# Altium schematic sheet nrf52840.SchDoc
size 1651 x 1651 mm
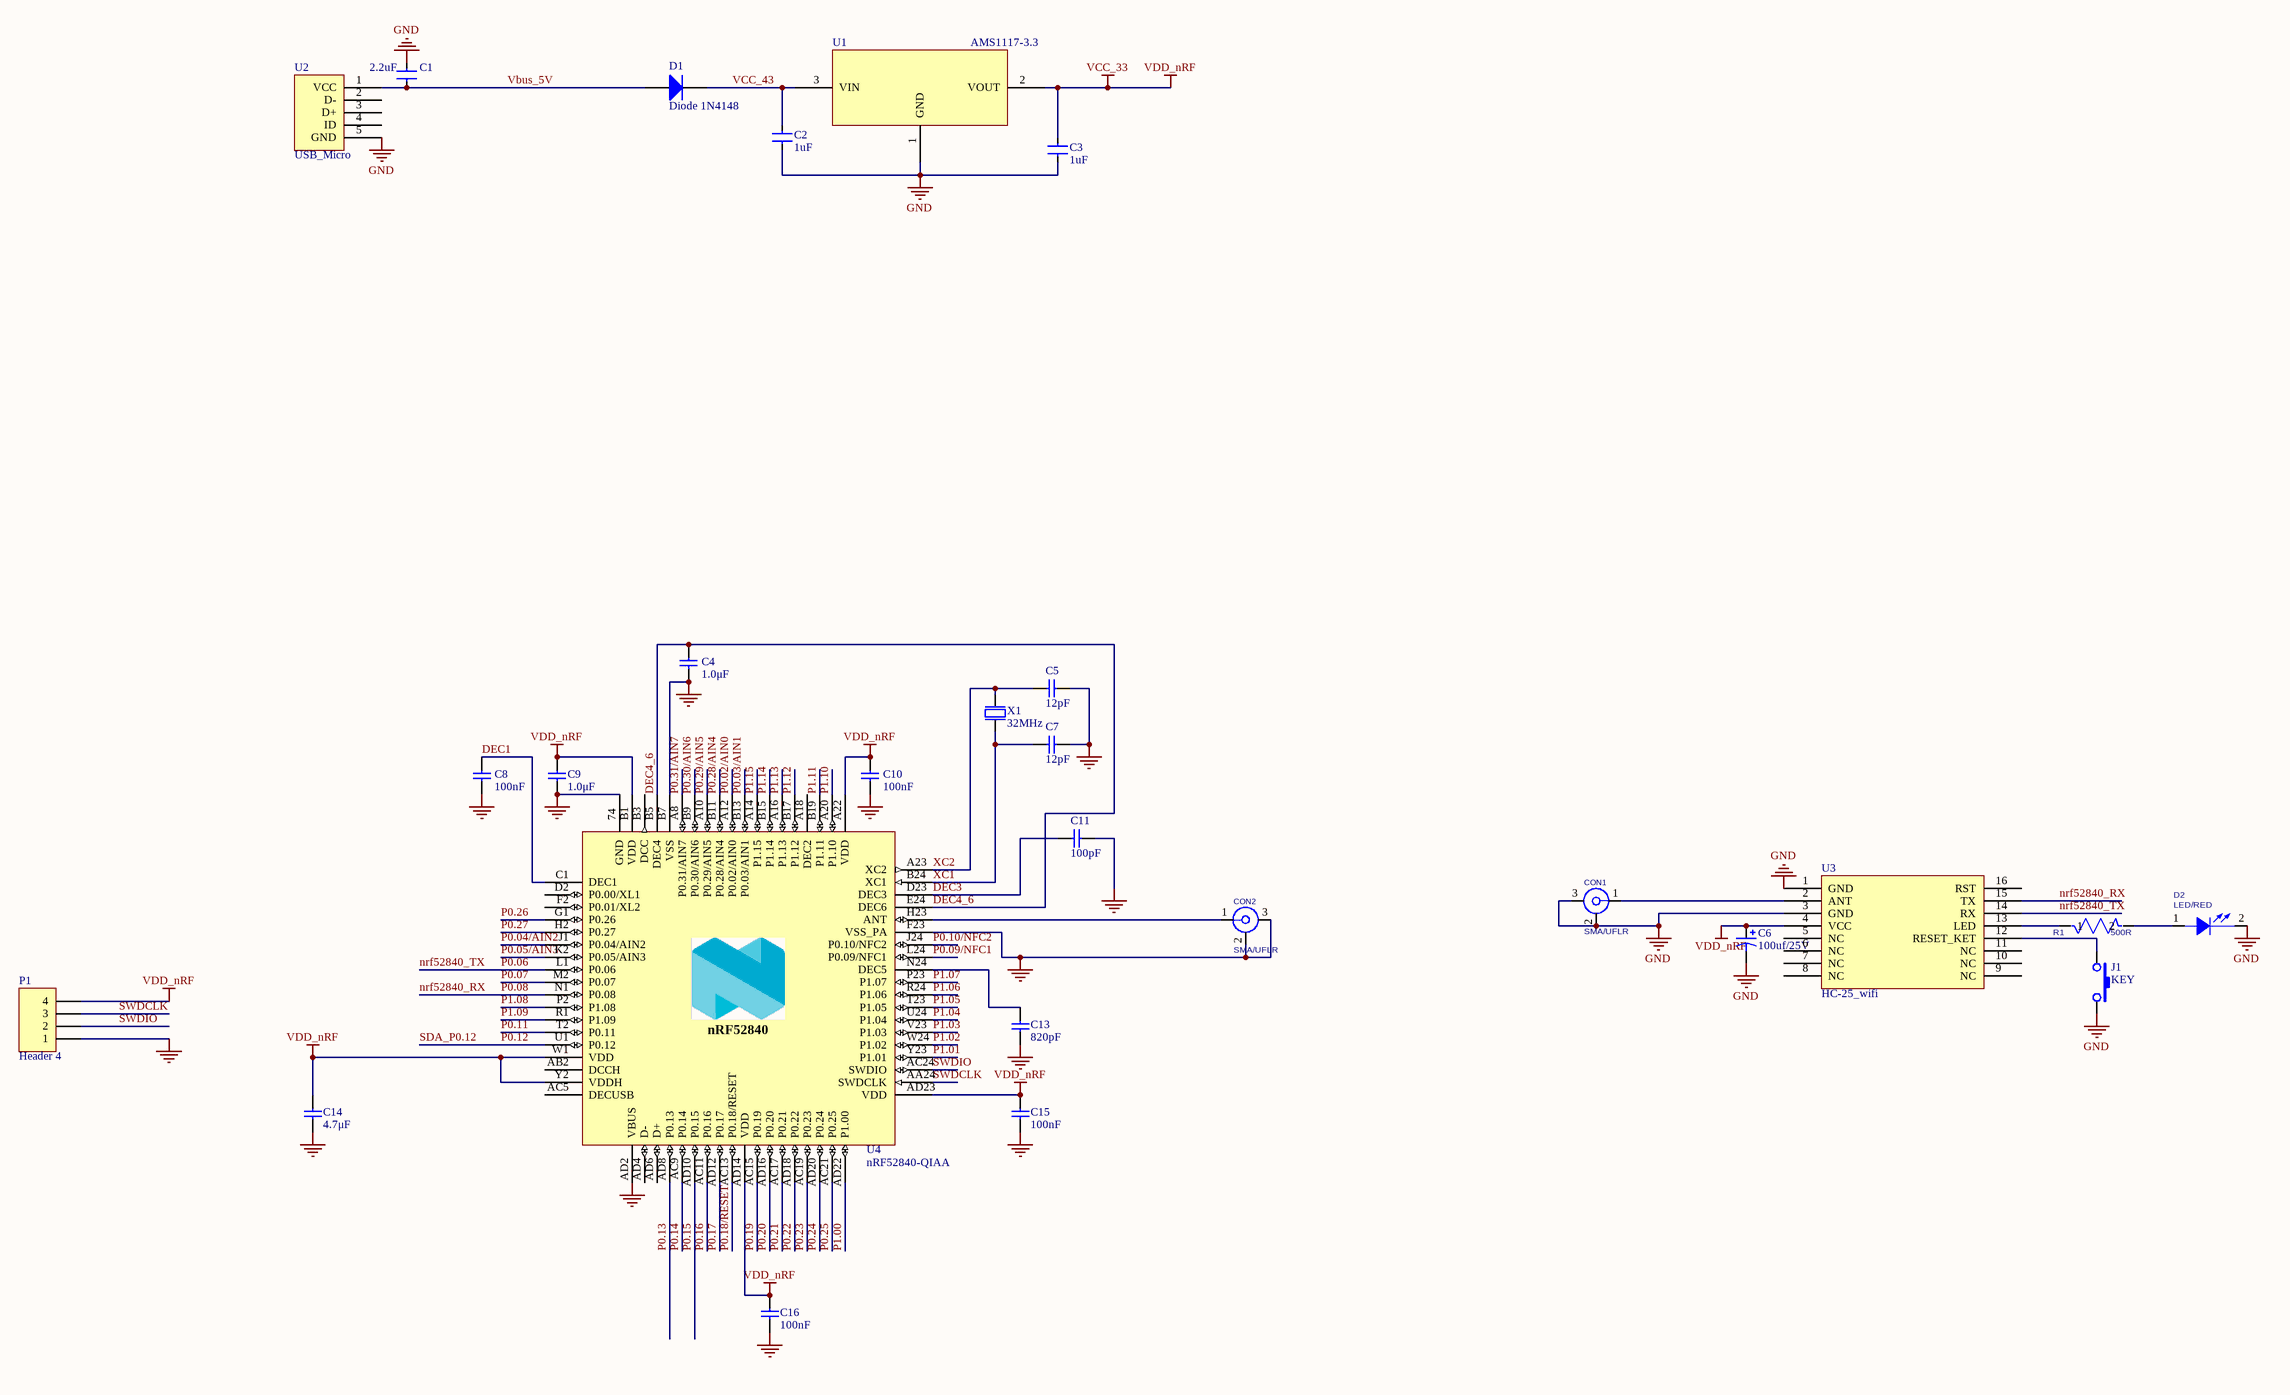
[diagram p0: nrf52840.SchDoc]

## Parts
C1  2.2uF  [0603-1]
C2  1uF  [0603-1]
C3  1uF  [0603-1]
C4  1.0μF  [0402-A]
C5  12pF  [0402-A]
C6  100uf/25V  [C_6.5_12.5_2.2_0.5]
C7  12pF  [0402-A]
C8  100nF  [0402-A]
C9  1.0μF  [0402-A]
C10  100nF  [0402-A]
C11  100pF  [0402-A]
C13  820pF  [0402-A]
C14  4.7μF  [0603-1]
C15  100nF  [0402-a]
C16  100nF  [0402-a]
CON1  SMA/UFLR  [IPX_U.FL]
CON2  SMA/UFLR  [IPX_U.FL]
D1  Diode 1N4148  [0805-1]
D2  LED/RED  [0805-1]
J1  KEY  [BUTTON_1]
P1  Header 4  [HDR1X4]
R1  500R  [0402-a]
U1  AMS1117-3.3  [SOT223_M]
U2  USB_Micro  [usb_micro]
U3  HC-25_wifi  [HC-25]
U4  nRF52840-QIAA  [AQFN50P700X700X85_HS-74N]
X1  32MHz  [SMD3225]

## Nets
GND: C1.2 C2.2 C3.2 C4.1 C5.2 C6.2 C7.2 C8.2 C9.2 C10.2 C11.2 C13.2 C14.2 C15.2 C16.2 CON1.2 CON1.3(GNDA) CON2.2 CON2.3(GNDA) D2.2(CATHODE) J1.1 P1.1 U1.1(GND) U2.5(GND) U3.1(GND) U3.3(GND) U4.74(GND) U4.AD2(VBUS) U4.B7(VSS) U4.F23(VSS_PA) X1.2(GND) X1.4(GND)
VCC_33: C3.1 C6.1 C9.1 C10.1 C14.1 C15.1 C16.1 P1.4 U1.2(VOUT) U3.4(VCC) U4.A22(VDD) U4.AD14(VDD) U4.AD23(VDD) U4.B1(VDD) U4.W1(VDD) U4.Y2(VDDH)  [also labelled VDD_nRF]
DEC1: C8.1 U4.C1(DEC1)
DEC3: C11.1 U4.D23(DEC3)
DEC4_6: C4.2 U4.B5(DEC4) U4.E24(DEC6)
nrf52840_RX: U3.15(TX) U4.N1(P0.08)  [also labelled P0.08]
nrf52840_TX: U3.14(RX) U4.L1(P0.06)  [also labelled P0.06]
P0.02/AIN0: U4.A12(P0.02/AIN0)
P0.03/AIN1: U4.B13(P0.03/AIN1)
P0.04/AIN2: U4.J1(P0.04/AIN2)
P0.05/AIN3: U4.K2(P0.05/AIN3)
P0.07: U4.M2(P0.07)
P0.09/NFC1: U4.L24(P0.09/NFC1)
P0.10/NFC2: U4.J24(P0.10/NFC2)
P0.11: U4.T2(P0.11)
P0.12: U4.U1(P0.12)  [also labelled SDA_P0.12]
P0.13: U4.AD8(P0.13)
P0.14: U4.AC9(P0.14)
P0.15: U4.AD10(P0.15)
P0.16: U4.AC11(P0.16)
P0.17: U4.AD12(P0.17)
P0.18/RESET: U4.AC13(P0.18/RESET)
P0.19: U4.AC15(P0.19)
P0.20: U4.AD16(P0.20)
P0.21: U4.AC17(P0.21)
P0.22: U4.AD18(P0.22)
P0.23: U4.AC19(P0.23)
P0.24: U4.AD20(P0.24)
P0.25: U4.AC21(P0.25)
P0.26: U4.G1(P0.26)
P0.27: U4.H2(P0.27)
P0.28/AIN4: U4.B11(P0.28/AIN4)
P0.29/AIN5: U4.A10(P0.29/AIN5)
P0.30/AIN6: U4.B9(P0.30/AIN6)
P0.31/AIN7: U4.A8(P0.31/AIN7)
P1.00: U4.AD22(P1.00)
P1.01: U4.Y23(P1.01)
P1.02: U4.W24(P1.02)
P1.03: U4.V23(P1.03)
P1.04: U4.U24(P1.04)
P1.05: U4.T23(P1.05)
P1.06: U4.R24(P1.06)
P1.07: U4.P23(P1.07)
P1.08: U4.P2(P1.08)
P1.09: U4.R1(P1.09)
P1.10: U4.A20(P1.10)
P1.11: U4.B19(P1.11)
P1.12: U4.B17(P1.12)
P1.13: U4.A16(P1.13)
P1.14: U4.B15(P1.14)
P1.15: U4.A14(P1.15)
SWDCLK: P1.3 U4.AA24(SWDCLK)
SWDIO: P1.2 U4.AC24(SWDIO)
Vbus_5V: C1.1 D1.1(A) U2.1(VCC)
VCC_43: C2.1 D1.2(K) U1.3(VIN)
XC1: C7.1 U4.B24(XC1) X1.1(inp)
XC2: C5.1 U4.A23(XC2) X1.3(out)
NetC13_1: C13.1 U4.N24(DEC5)
NetCON1_1: CON1.1 U3.2(ANT)
NetCON2_1: CON2.1 U4.H23(ANT)
NetD2_1: D2.1(ANODE) R1.2
NetJ1_2: J1.2 U3.12(RESET_KET)
NetR1_1: R1.1 U3.13(LED)

Not connected (* = marked no-connect by the designer): U2 2(D-) 3(D+) 4(ID); U3 5(NC) 6(NC) 7(NC) 8(NC) 9(NC) 10(NC) 11(NC) 16(RST); U4 A18(DEC2) AB2(DCCH) AC5(DECUSB) AD4(D-) AD6(D+) B3(DCC) D2(P0.00/XL1) F2(P0.01/XL2)

## Notes on the sheet
- (in symbol nRF52840-QIAAD0) nRF52840

## Library data of the parts
C1-C3 = CAP-0.1UF: SMD-CAP
C4 C9 = C0603-1?: Capacitor, X7R, ±10%; Part Number: C0603-1μ0; Note: 16V; LatestRevisionDate: 2013-06-05; Pin Count: 2; Publisher: Nordic Semiconductor; Published: 2009-05-08; Value: 1.0μF; Footprint Doc: 0603
C5 C7 = C0402-12p: Capacitor, NP0, ±2%; Note: 50V; Part Number: C0402-12p; LatestRevisionDate: 2011-05-11; Pin Count: 2; Publisher: Nordic Semiconductor; Published: 2009-05-08; Value: 12pF; Footprint Doc: 0402
C6 = Cap Pol1: Polarized Capacitor (Radial); Published: 8-Jun-2000; LatestRevisionDate: 17-Jul-2002; LatestRevisionNote: Re-released for DXP Platform.; PackageReference: RB7.6-15; Publisher: Altium Limited; PackageDescription: Polarized Capacitor (Radial); 2 Leads; Value: 100uf/25V
C8 C10 C15 C16 = C0402-100n: Capacitor, X7R, ±10%; Note: 16V; Part Number: C0402-100n; LatestRevisionDate: 2009-11-23; Pin Count: 2; Publisher: Nordic Semiconductor; Published: 2009-05-08; Value: 100nF; Footprint Doc: 0402
C11 = C0402-100p: Capacitor, NP0, ±5%; Note: 50V; Part Number: C0402-100p; LatestRevisionDate: 2009-05-08; Pin Count: 2; Publisher: Nordic Semiconductor; Published: 2009-05-08; Value: 100pF; Footprint Doc: 0402
C13 = C0402-820p: Capacitor, NP0, ±5%; Note: 50V; Part Number: C0402-820p; LatestRevisionDate: 2009-05-08; Pin Count: 2; Publisher: Nordic Semiconductor; Published: 2009-05-08; Value: 820pF; Footprint Doc: 0402
C14 = C0603-4μ7-: Capacitor, X7R, ±10%; Part Number: C0603-4μ7-6.3V-X7R; Note: 6.3V; LatestRevisionDate: 2015-06-10; Pin Count: 2; Publisher: Nordic Semiconductor; Published: 2015-06-10; Value: 4.7μF; Footprint Doc: 0603
CON1 CON2 = SMA/UFLR: Source_Path: D:\SCH\ORCAD\DANIEL\CONNECT.OLB; PCB DECAL: IPX_U.FL
D1 = Diode 1N4148: High Conductance Fast Diode; Published: 8-Jun-2000; LatestRevisionDate: 17-Jul-2002; LatestRevisionNote: Re-released for DXP Platform.; DatasheetDocument: 1997; PackageReference: DO-35; Publisher: Altium Limited; Code_JEDEC: DO-204-AH; ComponentLink1Description: Manufacturer Link; ComponentLink1URL: http://www.fairchildsemi.com/; ComponentLink2Description: Datasheet; ComponentLink2URL: http://www.fairchildsemi.com/ds/1N%2F1N4148.pdf
D2 = LED/0603: PCB DECAL: D1206; Source_Path: C:\SCH\ORCAD\DANIEL\KANG-LIB1.OLB; Value: 冰蓝色LED
P1 = Header 4: Header, 4-Pin; LatestRevisionDate: 17-Jul-2002; LatestRevisionNote: Re-released for DXP Platform.; Publisher: Altium Limited
R1 = R: PCB DECAL: R0402
U1 = MCP170
U4 = nRF52840-QIAAD0: Multi-protocol Bluetooth Low Energy, IEEE 802.15.4, ANT and 2.4GHz proprietary system-on-chip; Manufacturer: Nordic Semiconductor; Part Number: nRF52840-QIAAD0; LatestRevisionDate: 2018-12-04; Pin Count: 73; Publisher: Nordic Semiconductor; Published: 2018-12-04; Value: nRF52840-QIAA; Note: *; Footprint Doc: AQFN-73; Manufacturer Part Number: nRF52840-QIAAD0
X1 = XTAL_SMD2016_32MHz_8pF_General: XTAL SMD 2016, 32MHz, Cl=8pF, Total Tol: ±40ppm; Part Number: XTAL_SMD2016_32MHz_8pF_General; LatestRevisionDate: 2016-08-19; Pin Count: 4; Publisher: Nordic Semiconductor; Published: 2016-08-19; Value: 32MHz; Footprint Doc: XTAL_2016